# EAGLE schematic Robosapien1 (EAGLE 7.2.0)
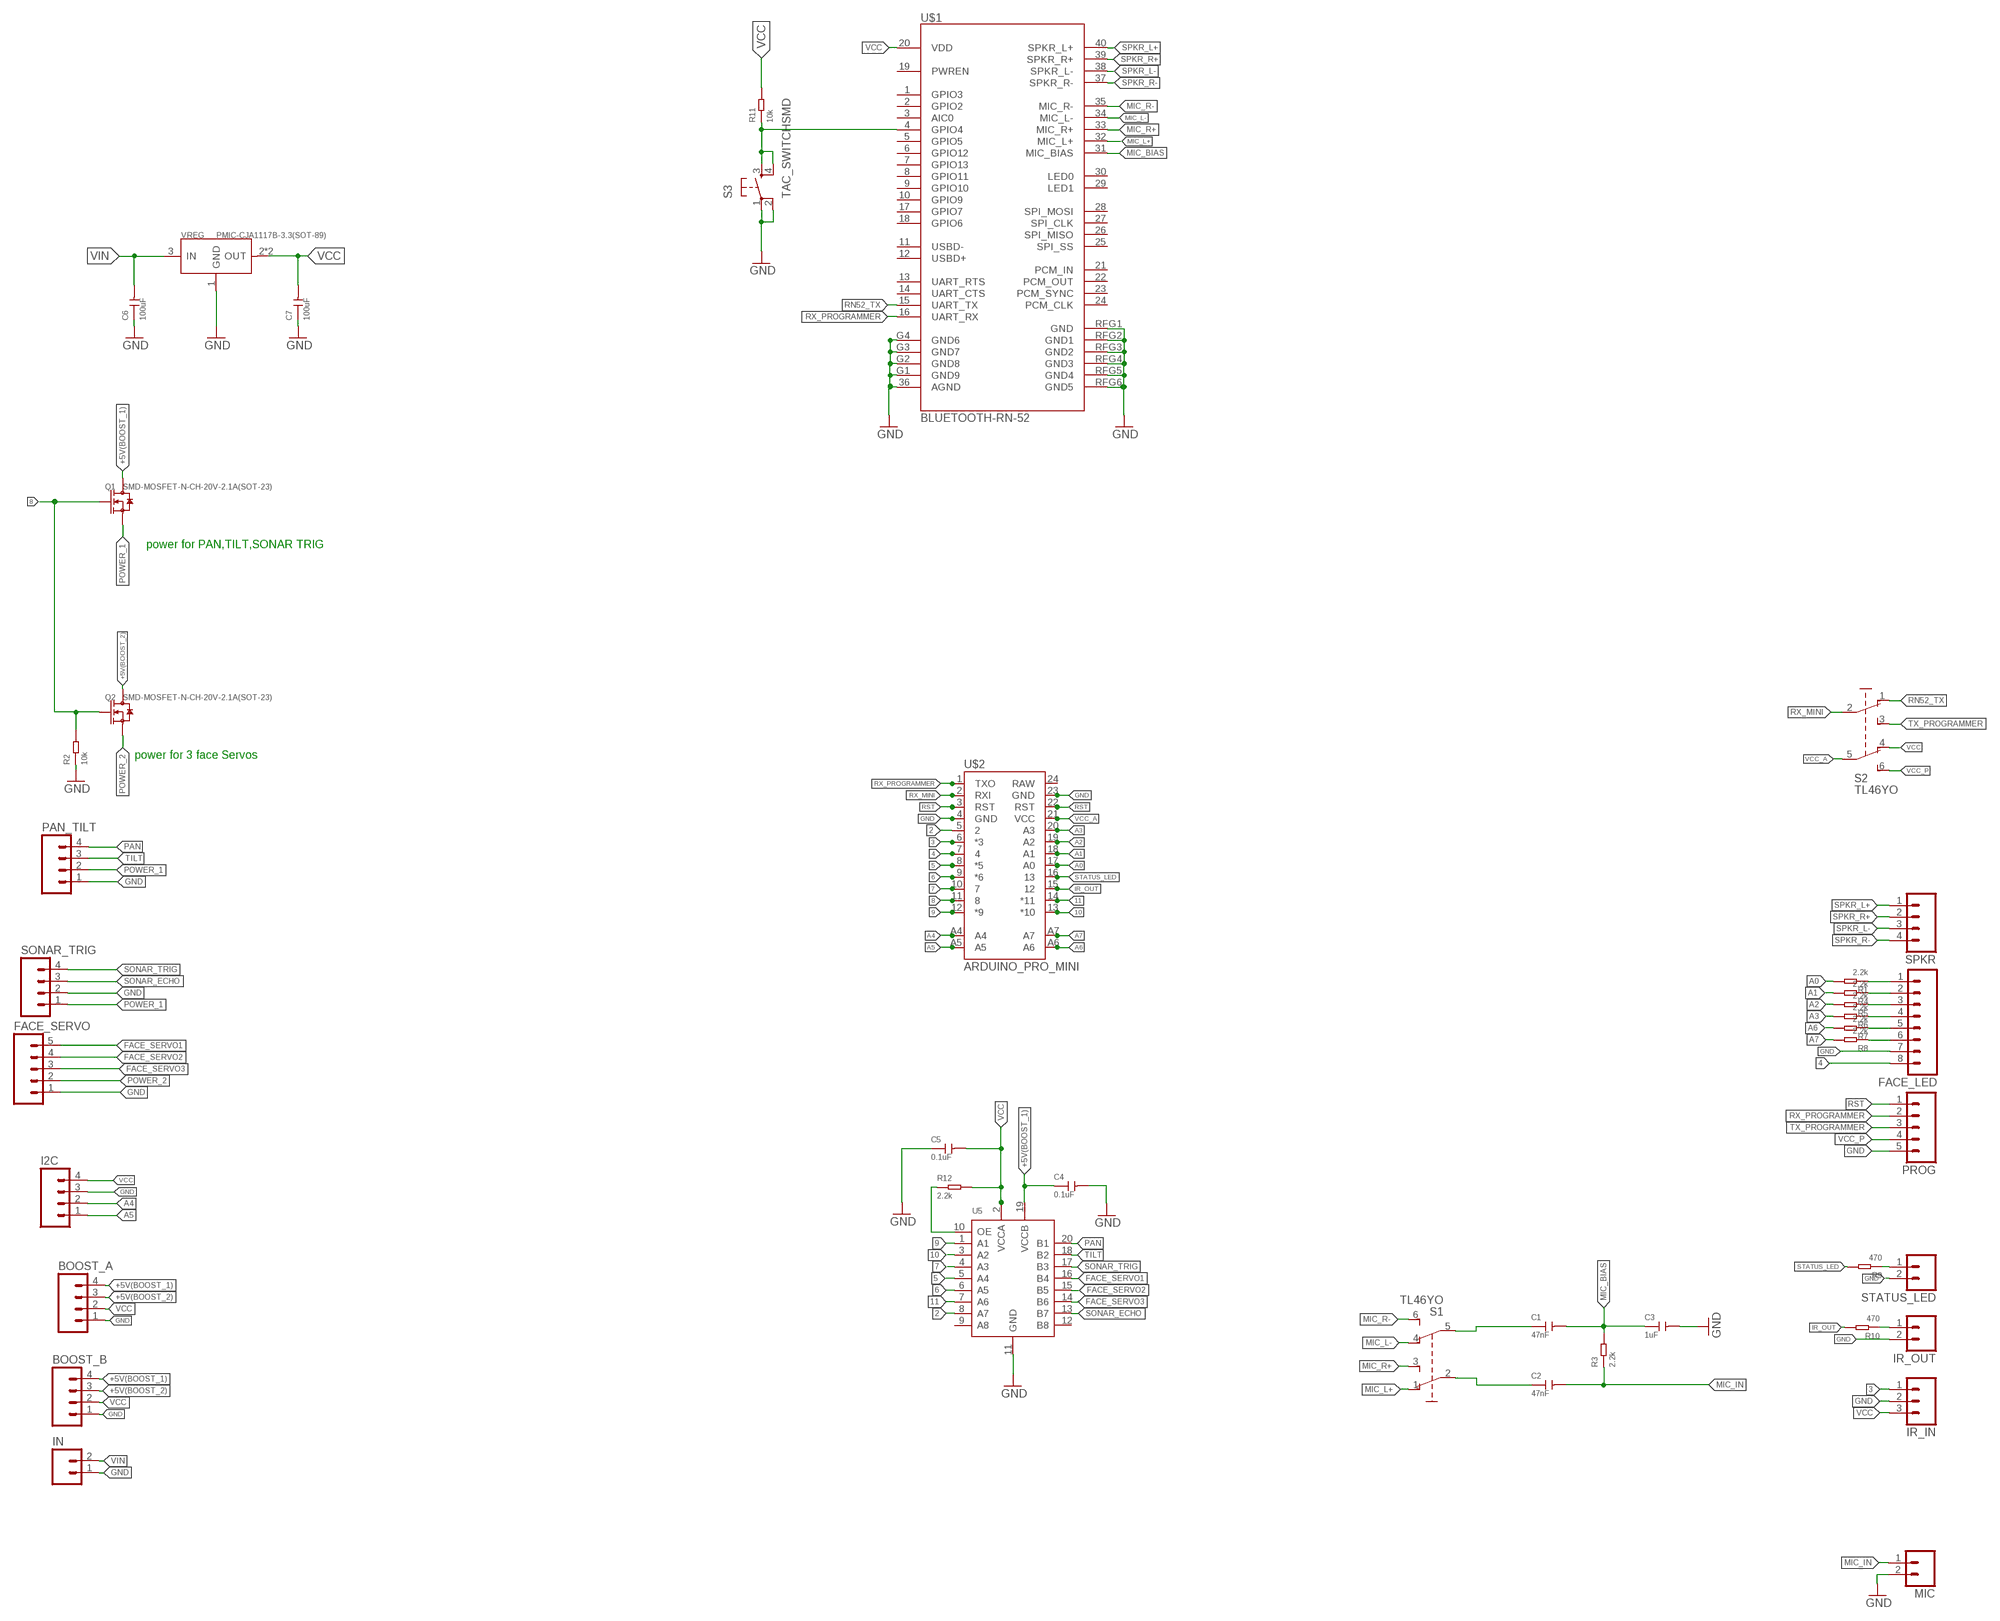
[diagram p0: schematic, sheet 1]

## Parts
BOOST_A  M04PTH  [1X04]
BOOST_B  M04PTH  [1X04]
C1  47nF  CAP-0402S  [C0402S]
C2  47nF  CAP-0402S  [C0402S]
C3  1uF  CAP-0402S  [C0402S]
C4  0.1uF  CAP-0402S  [C0402S]
C5  0.1uF  CAP-0402S  [C0402S]
C6  100uF  CAP-0402S  [C0402S]
C7  100uF  CAP-0402S  [C0402S]
FACE_LED  M08  [1X08_ROUND]
FACE_SERVO  M05PTH  [1X05]
I2C  M04PTH  [1X04]
IN  M02PTH  [1X02]
IR_IN  M03PTH  [1X03]
IR_OUT  M02PTH  [1X02]
MIC  M02PTH  [1X02]
PAN_TILT  M04PTH  [1X04]
PROG  M05PTH  [1X05]
Q1  SMD-MOSFET-N-CH-20V-2.1A(SOT-23)  [SOT-23]
Q2  SMD-MOSFET-N-CH-20V-2.1A(SOT-23)  [SOT-23]
R1  2.2k  RES'-0402S'  [R0402S]
R2  10k  RES'-0402S'  [R0402S]
R3  2.2k  RES'-0402S'  [R0402S]
R4  2.2k  RES'-0402S'  [R0402S]
R5  2.2k  RES'-0402S'  [R0402S]
R6  2.2k  RES'-0402S'  [R0402S]
R7  2.2k  RES'-0402S'  [R0402S]
R8  2.2k  RES'-0402S'  [R0402S]
R9  470  RES'-0402S'  [R0402S]
R10  470  RES'-0402S'  [R0402S]
R11  10k  RES'-0402S'  [R0402S]
R12  2.2k  RES'-0402S'  [R0402S]
S1  TL46YO  [TL4XYO]
S2  TL46YO  [TL4XYO]
S3  TAC_SWITCHSMD  [TACTILE-SWITCH-SMD]
SONAR_TRIG  M04PTH  [1X04]
SPKR  M04PTH  [1X04]
STATUS_LED  M02PTH  [1X02]
U5  LOGIC-TXS0108EPWR(TSSOP20)  [TSSOP20-0.65-6.5X4.4MM]
U$1  BLUETOOTH-RN-52  [RN-52]
U$2  ARDUINO_PRO_MINI  [ARDUINO_PRO_MINI]
VREG  PMIC-CJA1117B-3.3(SOT-89)  [SOT-89]

## Nets
2: U5.8(A7) U$2.5
3: IR_IN.1 U$2.6(*3)
4: FACE_LED.8 U$2.7
5: U5.5(A4) U$2.8(*5)
6: U5.6(A5) U$2.9(*6)
7: U5.4(A3) U$2.10
8: Q1.1(G) Q2.1(G) R2.2 U$2.11
9: U5.1(A1) U$2.12(*9)
10: U5.3(A2) U$2.13(*10)
11: U5.7(A6) U$2.14(*11)
+5V(BOOST_1): BOOST_A.4 BOOST_B.4 C4.1 Q1.3(D) U5.19(VCCB)
+5V(BOOST_2): BOOST_A.3 BOOST_B.3 Q2.3(D)
A0: R1.2 U$2.17(A0)
A1: R4.2 U$2.18(A1)
A2: R5.2 U$2.19(A2)
A3: R6.2 U$2.20(A3)
A4: I2C.2 U$2.A4
A5: I2C.1 U$2.A5
A6: R7.2 U$2.A6
A7: R8.2 U$2.A7
FACE_SERVO1: FACE_SERVO.5 U5.16(B4)
FACE_SERVO2: FACE_SERVO.4 U5.15(B5)
FACE_SERVO3: FACE_SERVO.3 U5.14(B6)
GND: BOOST_A.1 BOOST_B.1 C3.2 C4.2 C5.1 C6.1 C7.1 FACE_LED.7 FACE_SERVO.1 I2C.3 IN.1 IR_IN.2 IR_OUT.2 MIC.2 PAN_TILT.1 PROG.5 R2.1 S3.1 S3.2 SONAR_TRIG.2 STATUS_LED.2 U5.11(GND) U$1.36(AGND) U$1.G1(GND9) U$1.G2(GND8) U$1.G3(GND7) U$1.G4(GND6) U$1.RFG1(GND) U$1.RFG2(GND1) U$1.RFG3(GND2) U$1.RFG4(GND3) U$1.RFG5(GND4) U$1.RFG6(GND5) U$2.4(GND) U$2.23(GND) VREG.1(GND)
IR_OUT: R10.2 U$2.15
MIC_BIAS: C1.2 C3.1 R3.2 U$1.31(MIC_BIAS)
MIC_IN: C2.2 MIC.1 R3.1
MIC_L+: S1.1(O) U$1.32(MIC_L+)
MIC_L-: S1.4(O1) U$1.34(MIC_L-)
MIC_R+: S1.3(S) U$1.33(MIC_R+)
MIC_R-: S1.6(S1) U$1.35(MIC_R-)
N$1: C1.1 S1.5(P1)
N$2: R11.1 S3.3 S3.4 U$1.4(GPIO4)
N$3: C2.1 S1.2(P)
N$4: FACE_LED.1 R1.1
N$5: FACE_LED.2 R4.1
N$6: FACE_LED.3 R5.1
N$7: FACE_LED.4 R6.1
N$8: FACE_LED.5 R7.1
N$9: FACE_LED.6 R8.1
N$10: R12.1 U5.10(OE)
N$12: R9.1 STATUS_LED.1
N$14: IR_OUT.1 R10.1
PAN: PAN_TILT.4 U5.20(B1)
POWER_1: PAN_TILT.2 Q1.2(S) SONAR_TRIG.1
POWER_2: FACE_SERVO.2 Q2.2(S)
RN52_TX: S2.1(O) U$1.15(UART_TX)
RST: PROG.1 U$2.3(RST) U$2.22(RST)
RX_MINI: S2.2(P) U$2.2(RXI)
RX_PROGRAMMER: PROG.2 U$1.16(UART_RX) U$2.1(TXO)
SONAR_ECHO: SONAR_TRIG.3 U5.13(B7)
SONAR_TRIG: SONAR_TRIG.4 U5.17(B3)
SPKR_L+: SPKR.1 U$1.40(SPKR_L+)
SPKR_L-: SPKR.3 U$1.38(SPKR_L-)
SPKR_R+: SPKR.2 U$1.39(SPKR_R+)
SPKR_R-: SPKR.4 U$1.37(SPKR_R-)
STATUS_LED: R9.2 U$2.16
TILT: PAN_TILT.3 U5.18(B2)
TX_PROGRAMMER: PROG.3 S2.3(S)
VCC: BOOST_A.2 BOOST_B.2 C5.2 C7.2 I2C.4 IR_IN.3 R11.2 R12.2 S2.4(O1) U5.2(VCCA) U$1.20(VDD) VREG.2(OUT) VREG.4(OUT)
VCC_A: S2.5(P1) U$2.21(VCC)
VCC_P: PROG.4 S2.6(S1)
VIN: C6.2 IN.2 VREG.3(IN)
Unconnected: U5.9(A8) U5.12(B8) U$1.1(GPIO3) U$1.2(GPIO2) U$1.3(AIC0) U$1.5(GPIO5) U$1.6(GPIO12) U$1.7(GPIO13) U$1.8(GPIO11) U$1.9(GPIO10) U$1.10(GPIO9) U$1.11(USBD-) U$1.12(USBD+) U$1.13(UART_RTS) U$1.14(UART_CTS) U$1.17(GPIO7) U$1.18(GPIO6) U$1.19(PWREN) U$1.21(PCM_IN) U$1.22(PCM_OUT) U$1.23(PCM_SYNC) U$1.24(PCM_CLK) U$1.25(SPI_SS) U$1.26(SPI_MISO) U$1.27(SPI_CLK) U$1.28(SPI_MOSI) U$1.29(LED1) U$1.30(LED0) U$2.24(RAW)

## Notes on the sheet
- power for PAN,TILT,SONAR TRIG
- power for 3 face Servos

## Library data of the parts
BOOST_A BOOST_B I2C PAN_TILT SONAR_TRIG SPKR = SparkFun-Connectors:M04: Header 4 Standard 4-pin 0.1" header. Use with straight break away headers (SKU : PRT-00116), right angle break away headers (PRT-00553), swiss pins (PRT-00743), machine pins (PRT-00117), and female headers (PRT-00115). Molex polarized connector foot print use with SKU : PRT-08231 with associated crimp pins and housings. 1MM SMD Version SKU: PRT-10208
C1-C7 = Discrete:CAP: Ceramic Capacitors
FACE_LED = SparkFun-Connectors:M08: Header 8 Standard 8-pin 0.1" header. Use with straight break away headers (SKU : PRT-00116), right angle break away headers (PRT-00553), swiss pins (PRT-00743), machine pins (PRT-00117), and female headers (PRT-00115).
FACE_SERVO PROG = SparkFun-Connectors:M05: Header 5 Standard 5-pin 0.1" header. Use with straight break away headers (SKU : PRT-00116), right angle break away headers (PRT-00553), swiss pins (PRT-00743), machine pins (PRT-00117), and female headers (PRT-00115). Molex polarized connector foot print use with SKU : PRT-08230 with associated crimp pins and housings.
IN IR_OUT MIC STATUS_LED = SparkFun-Connectors:M02: Standard 2-pin 0.1" header. Use with - straight break away headers ( PRT-00116) - right angle break away headers (PRT-00553) - swiss pins (PRT-00743) - machine pins (PRT-00117) - female headers (PRT-00115) Molex polarized connector foot print use with: PRT-08233 with associated crimp pins and housings. 2.54_SCREWTERM for use with PRT-10571. 3.5mm Screw Terminal footprints for PRT-08084 5mm Screw Terminal footprints for use with PRT-08432
IR_IN = SparkFun-Connectors:M03: Header 3 Standard 3-pin 0.1" header. Use with straight break away headers (SKU : PRT-00116), right angle break away headers (PRT-00553), swiss pins (PRT-00743), machine pins (PRT-00117), and female headers (PRT-00115). Molex polarized connector foot print use with SKU : PRT-08232 with associated crimp pins and housings.
Q1 Q2 = OPL-Transistor:SMD-MOSFET-N-CH-20V-2.1A(SOT-23): 305030015; MPN: CJ2302
R1-R12 = Discrete:RES
S1 S2 = switch:TL46YO: TINY SWITCH ON - ON Source: http://www2.produktinfo.conrad.com/datenblaetter/700000-724999/705152-da-01-de-Subminiaturschalter_TL_36YO.pdf
S3 = SparkFun-Retired:TAC_SWITCH: Momentary Switch Button commonly used for reset or general input. Spark Fun Electronics SKU : COM-00097 SMT- SWCH-08247; PROD_ID: SWCH-08247
U5 = OPL-ic:LOGIC-TXS0108EPWR(TSSOP20): 310050026; DESCRIPTION: level-shift-buffer
U$1 = SparkFun-RF:BLUETOOTH-RN-52
U$2 = SparkFun-Boards:ARDUINO_PRO_MINI
VREG = OPL-ic:PMIC-CJA1117B-3.3(SOT-89): 310030095; MPN: PMIC-LDO-Vin-5V-Vout-3.3V-1A